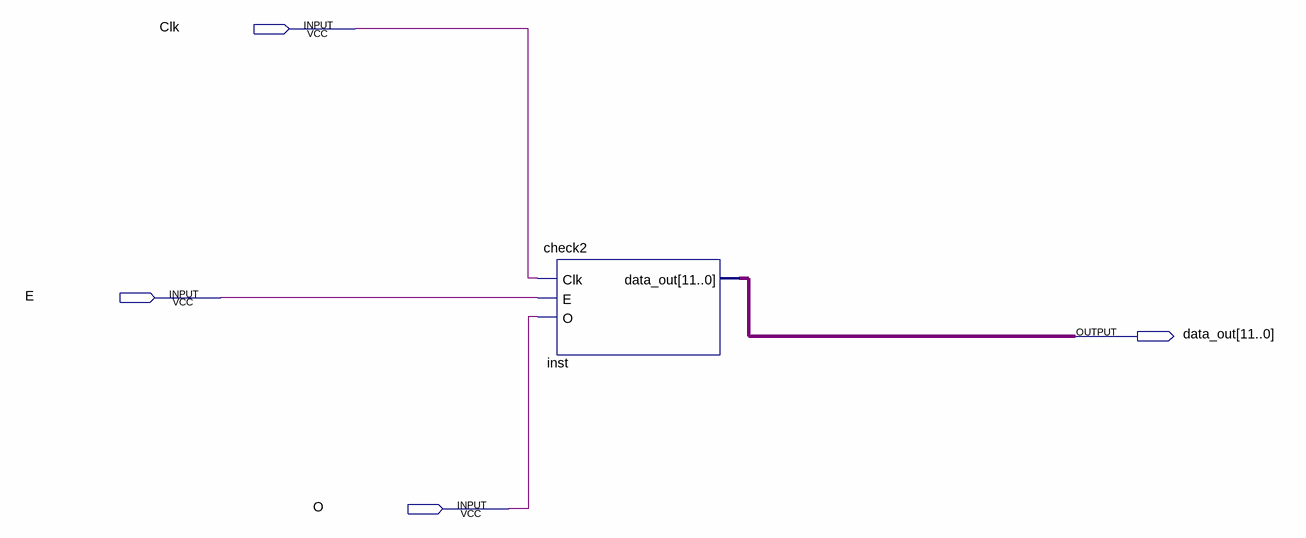
[diagram p0: schematic sheet]
// Quartus schematic check2.bdf as structural Verilog: 1 symbols, 4 pins
module check2 (
  input  Clk,
  input  E,
  input  O,
  output [11:0] data_out
);

  check2 inst (.Clk(Clk), .E(E), .O(O), .data_out(data_out));
endmodule
